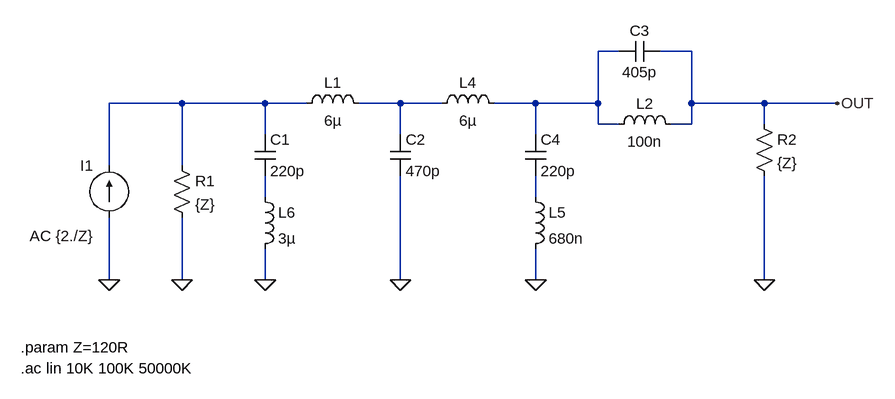
[diagram p0: schematic filter.asc]
filter.asc, the LTspice schematic file:
Version 4
SHEET 1 1624 680
WIRE 640 16 608 16
WIRE 752 16 704 16
WIRE -32 96 -144 96
WIRE 96 96 -32 96
WIRE 160 96 96 96
WIRE 304 96 240 96
WIRE 368 96 304 96
WIRE 512 96 448 96
WIRE 608 96 608 16
WIRE 608 96 512 96
WIRE 752 96 752 16
WIRE 864 96 752 96
WIRE 976 96 864 96
WIRE 608 128 608 96
WIRE 640 128 608 128
WIRE 752 128 752 96
WIRE 752 128 720 128
WIRE 864 128 864 96
WIRE 96 144 96 96
WIRE 304 144 304 96
WIRE 512 144 512 96
WIRE -144 192 -144 96
WIRE -32 192 -32 96
WIRE 96 240 96 208
WIRE 512 240 512 208
WIRE -144 368 -144 272
WIRE -32 368 -32 272
WIRE 96 368 96 320
WIRE 304 368 304 208
WIRE 512 368 512 320
WIRE 864 368 864 208
FLAG -32 368 0
FLAG 96 368 0
FLAG 304 368 0
FLAG 864 368 0
FLAG -144 368 0
FLAG 976 96 OUT
FLAG 512 368 0
SYMBOL ind 144 112 R270
WINDOW 0 32 56 VTop 2
WINDOW 3 5 56 VBottom 2
SYMATTR InstName L1
SYMATTR Value 6µ
SYMBOL cap 80 144 R0
SYMATTR InstName C1
SYMATTR Value 220p
SYMBOL cap 288 144 R0
SYMATTR InstName C2
SYMATTR Value 470p
SYMBOL res -48 176 R0
SYMATTR InstName R1
SYMATTR Value {Z}
SYMBOL res 848 112 R0
SYMATTR InstName R2
SYMATTR Value {Z}
SYMBOL current -144 272 R180
WINDOW 0 24 80 Left 2
WINDOW 3 24 0 Left 2
WINDOW 123 24 -28 Left 2
WINDOW 39 0 0 Left 0
SYMATTR InstName I1
SYMATTR Value ""
SYMATTR Value2 AC {2./Z}
SYMBOL cap 704 0 R90
WINDOW 0 0 32 VBottom 2
WINDOW 3 32 32 VTop 2
SYMATTR InstName C3
SYMATTR Value 405p
SYMBOL ind 624 144 R270
WINDOW 0 32 56 VTop 2
WINDOW 3 5 56 VBottom 2
SYMATTR InstName L2
SYMATTR Value 100n
SYMBOL ind 352 112 R270
WINDOW 0 32 56 VTop 2
WINDOW 3 5 56 VBottom 2
SYMATTR InstName L4
SYMATTR Value 6µ
SYMBOL cap 496 144 R0
SYMATTR InstName C4
SYMATTR Value 220p
SYMBOL ind 80 224 R0
SYMATTR InstName L6
SYMATTR Value 3µ
SYMBOL ind 496 224 R0
SYMATTR InstName L5
SYMATTR Value 680n
TEXT -280 504 Left 2 !.ac lin 10K 100K 50000K
TEXT -280 472 Left 2 !.param Z=120R

The netlist it stands for:
* filter.asc
L1 N002 N003 6µ
C1 N002 N004 220p
C2 N003 0 470p
R1 N002 0 {Z}
R2 OUT 0 {Z}
I1 0 N002 AC {2./Z}
C3 OUT N001 405p
L2 N001 OUT 100n
L4 N003 N001 6µ
C4 N001 N005 220p
L6 N004 0 3µ
L5 N005 0 680n
.ac lin 10K 100K 50000K
.param Z=120R
.backanno
.end